# EAGLE schematic wiiceiver v1 (EAGLE 6.5.0)
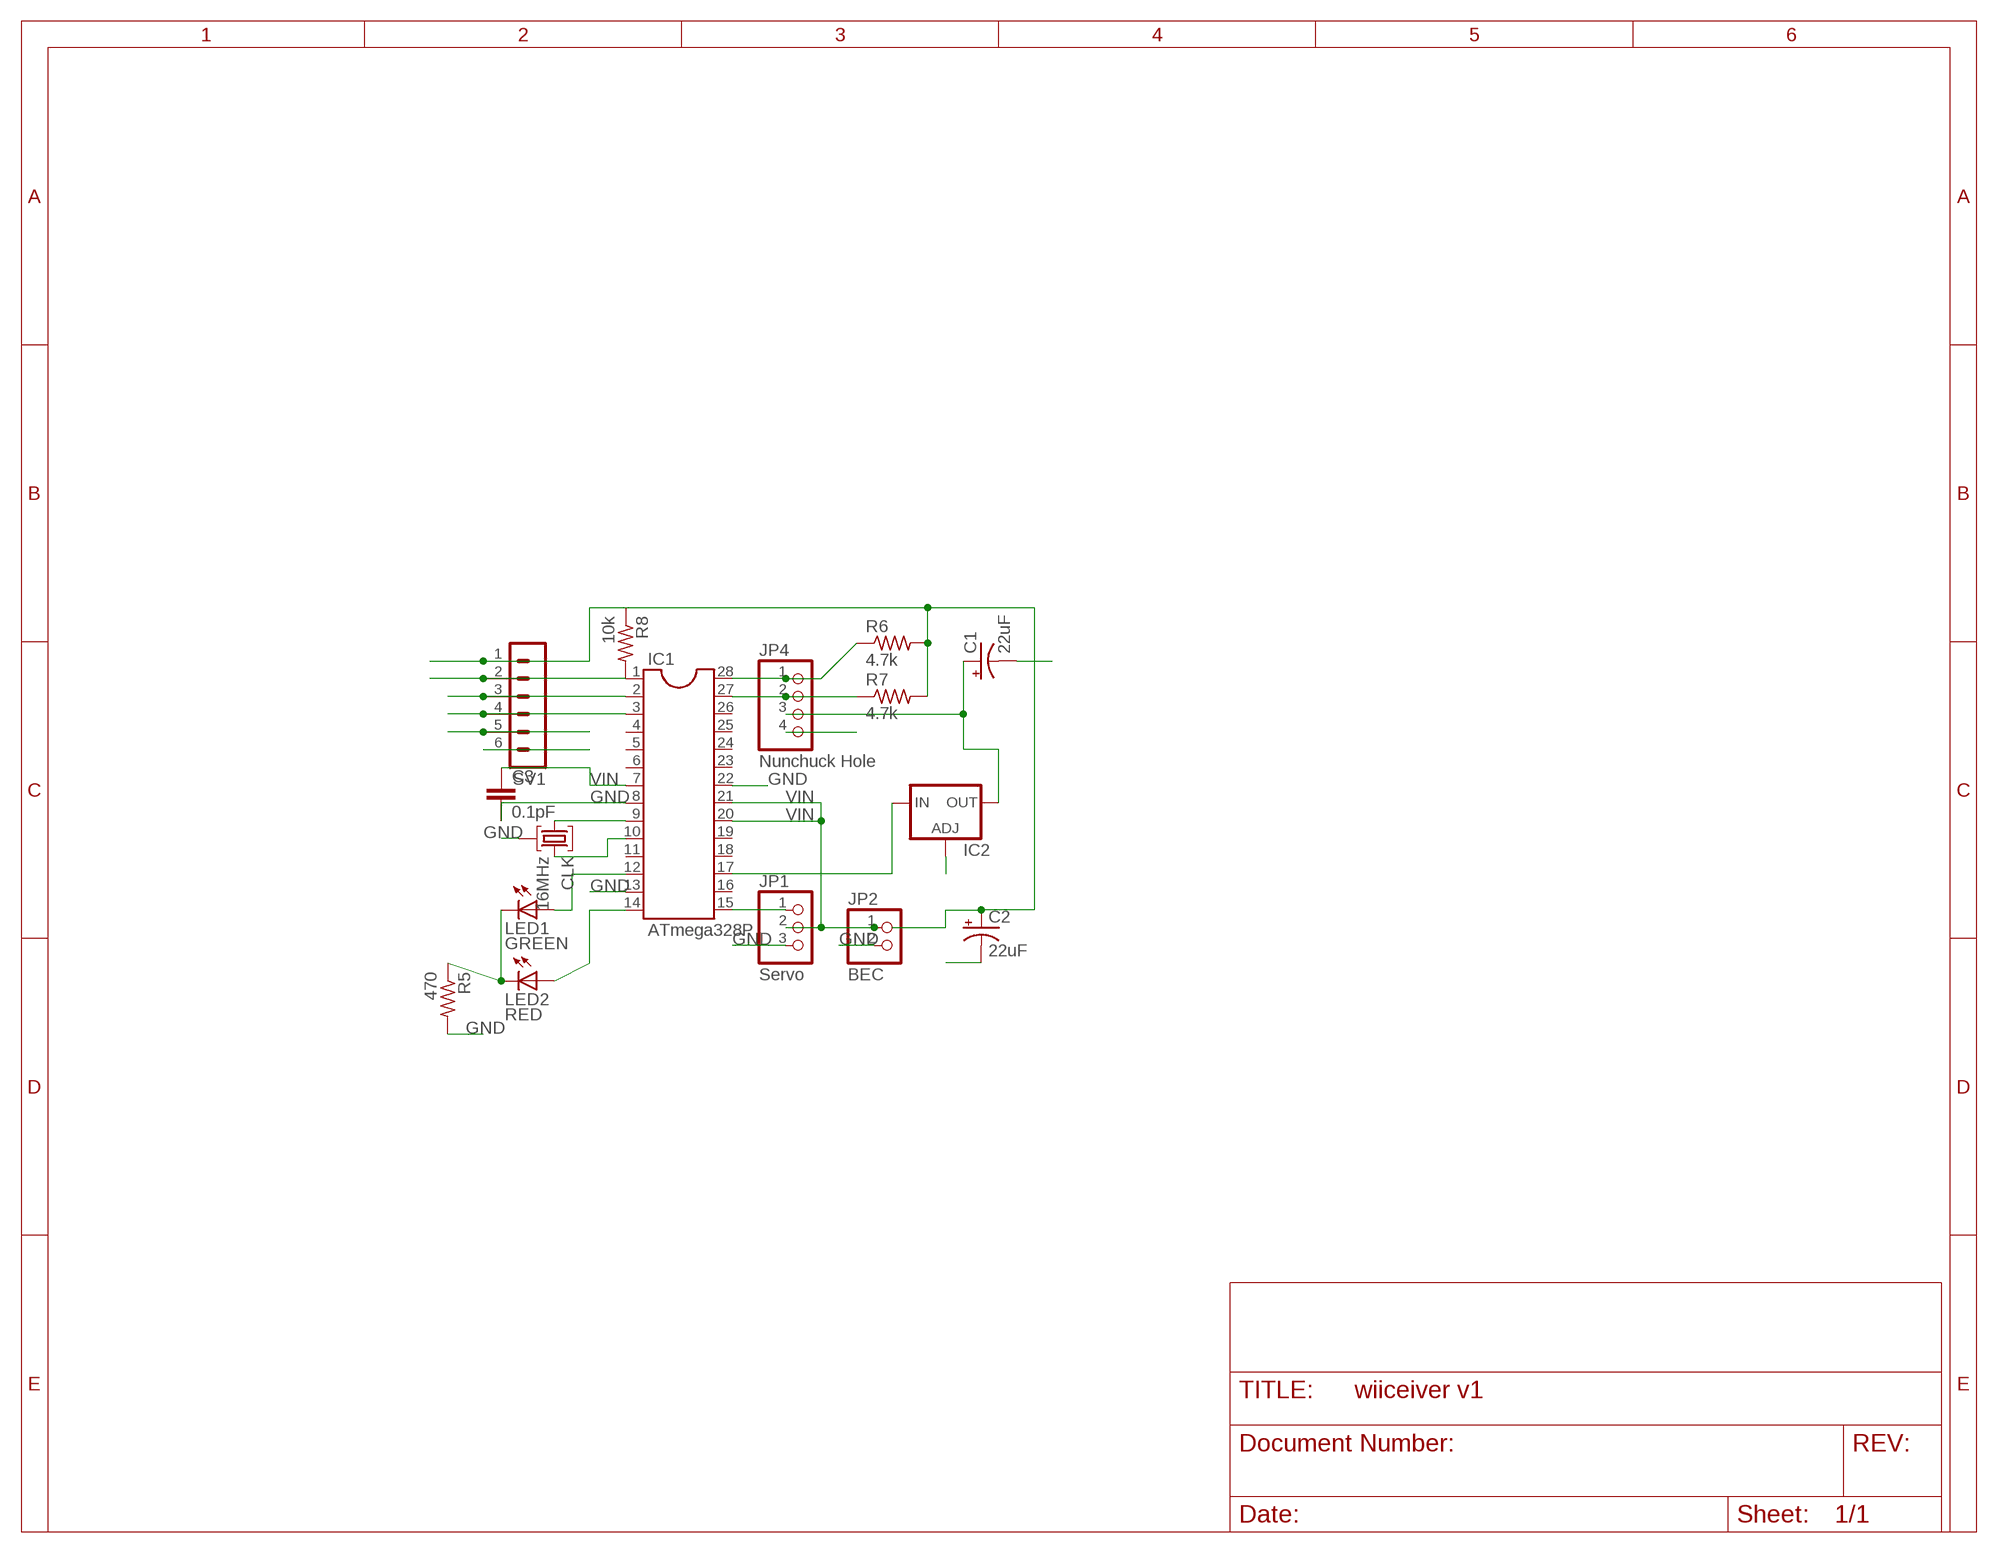
[diagram p0: schematic, sheet 1]

## Parts
C1  22uF  CPOL-USB45181A  [B45181A]
C2  22uF  CPOL-USB45181A  [B45181A]
C3  0.1pF  C5/2.5  [C5B2.5]
CLK  16MHz  IXFA  [HC49U]
IC1  ATmega328P  DIL28-3  [DIL28-3]
IC2  LM317TS  [317TS]
JP1  Servo  PINHD-1X3  [1X03]
JP2  BEC  PINHD-1X2  [1X02]
JP4  Nunchuck Hole  PINHD-1X4  [1X04]
LED1  GREEN  LED3MM  [LED3MM]
LED2  RED  LED3MM  [LED3MM]
R5  470  R-US_0204/2V  [0204V]
R6  4.7k  R-US_0204/2V  [0204V]
R7  4.7k  R-US_0204/2V  [0204V]
R8  10k  R-US_0204/2V  [0204V]
SV1  MA06-1  [MA06-1]

## Nets
DIP12: IC1.12 LED1.A
GND: C1.- C2.- C3.2 CLK.2 IC1.8 IC1.13 IC1.22 IC2.1(ADJ) JP1.3 JP2.2 JP4.4 R5.2 SV1.5 SV1.6
N$1: IC1.15 JP1.1
N$2: IC1.1 R8.2 SV1.2
N$6: LED1.K(C) LED2.K(C) R5.1
N$7: IC1.14 LED2.A
N$9: CLK.3 IC1.10
N$10: IC1.17 IC2.3(IN)
N$11: CLK.1 IC1.9
N$16: C1.+ IC2.2(OUT) JP4.3
N$21: IC1.28 JP4.1 R6.1
N$22: IC1.27 JP4.2 R7.1
RX: IC1.2 SV1.3
TX: IC1.3 SV1.4
VIN: C2.+ C3.1 IC1.7 IC1.20 IC1.21 JP1.2 JP2.1 R6.2 R7.2 R8.1 SV1.1
Unconnected: IC1.4 IC1.5 IC1.6 IC1.11 IC1.16 IC1.18 IC1.19 IC1.23 IC1.24 IC1.25 IC1.26

## Library data of the parts
C1 C2 = resistor:CPOL-US: POLARIZED CAPACITOR, American symbol
C3 = capacitor-wima:C: CAPACITOR naming: grid - package width
CLK = crystal:IXF: Crystal Filter Source: www.ilsiamerica.com .. C1 IXF Series.pdf; OC_FARNELL: unknown; OC_NEWARK: unknown
IC1 = ic-package:DIL28: Dual In Line
IC2 = v-reg:LM317TS: VOLTAGE REGULATOR
JP1 = pinhead:PINHD-1X3: PIN HEADER
JP2 = pinhead:PINHD-1X2: PIN HEADER
JP4 = pinhead:PINHD-1X4: PIN HEADER
LED1 LED2 = led:LED: LED OSRAM: - CHIPLED LG R971, LG N971, LY N971, LG Q971, LY Q971, LO R971, LY R971 LH N974, LH R974 LS Q976, LO Q976, LY Q976 LO Q996 - Hyper CHIPLED LW Q18S LB Q993, LB Q99A, LB R99A - SideLED LS A670, LO A670, LY A670, LG A670, LP A670 LB A673, LV A673, LT A673, LW A673 LH A674 LY A675 LS A676, LA A676, LO A676, LY A676, LW A676 LS A679, LY A679, LG A679 - Hyper Micro SIDELED® LS Y876, LA Y876, LO Y876, LY Y876 LT Y87S - SmartLED LW L88C, LW L88S LB L89C, LB L89S, LG L890 LS L89K, LO L89K, LY L89K LS L896, LA L896, LO L896, LY L896 - TOPLED LS T670, LO T670, LY T670, LG T670, LP T670 LSG T670, LSP T670, LSY T670, LOP T670, LYG T670 LG T671, LOG T671, LSG T671 LB T673, LV T673, LT T673, LW T673 LH T674 LS T676, LA T676, LO T676, LY T676, LB T676, LH T676, LSB T676, LW T676 LB T67C, LV T67C, LT T67C, LS T67K, LO T67K, LY T67K, LW E67C LS E67B, LA E67B, LO E67B, LY E67B, LB E67C, LV E67C, LT E67C LW T67C LS T679, LY T679, LG T679 LS T770, LO T770, LY T770, LG T770, LP T770 LB T773, LV T773, LT T773, LW T773 LH T774 LS E675, LA E675, LY E675, LS T675 LS T776, LA T776, LO T776, LY T776, LB T776 LHGB T686 LT T68C, LB T68C - Hyper Mini TOPLED® LB M676 - Mini TOPLED Santana® LG M470 LS M47K, LO M47K, LY M47K Source: http://www.osram.convergy.de LUXEON: - LUMILED® LXK2-PW12-R00, LXK2-PW12-S00, LXK2-PW14-U00, LXK2-PW14-V00 LXK2-PM12-R00, LXK2-PM12-S00, LXK2-PM14-U00 LXK2-PE12-Q00, LXK2-PE12-R00, LXK2-PE12-S00, LXK2-PE14-T00, LXK2-PE14-U00 LXK2-PB12-K00, LXK2-PB12-L00, LXK2-PB12-M00, LXK2-PB14-N00, LXK2-PB14-P00, LXK2-PB14-Q00 LXK2-PR12-L00, LXK2-PR12-M00, LXK2-PR14-Q00, LXK2-PR14-R00 LXK2-PD12-Q00, LXK2-PD12-R00, LXK2-PD12-S00 LXK2-PH12-R00, LXK2-PH12-S00 LXK2-PL12-P00, LXK2-PL12-Q00, LXK2-PL12-R00 Source: www.luxeon.com KINGBRIGHT: KA-3528ASYC Source: www.kingbright.com
R5-R8 = resistor:R-US_: RESISTOR, American symbol
SV1 = con-lstb:MA06-1: PIN HEADER; OC_FARNELL: unknown; OC_NEWARK: unknown